# Altium schematic sheet IO_Combo_USB_Serial.SchDoc: USB Serial
size Tabloid; Date: 09/21/2024; Engineer: Terry D. Schevker; Revision: 1.0; SheetNumber: 4; SheetTotal: 5
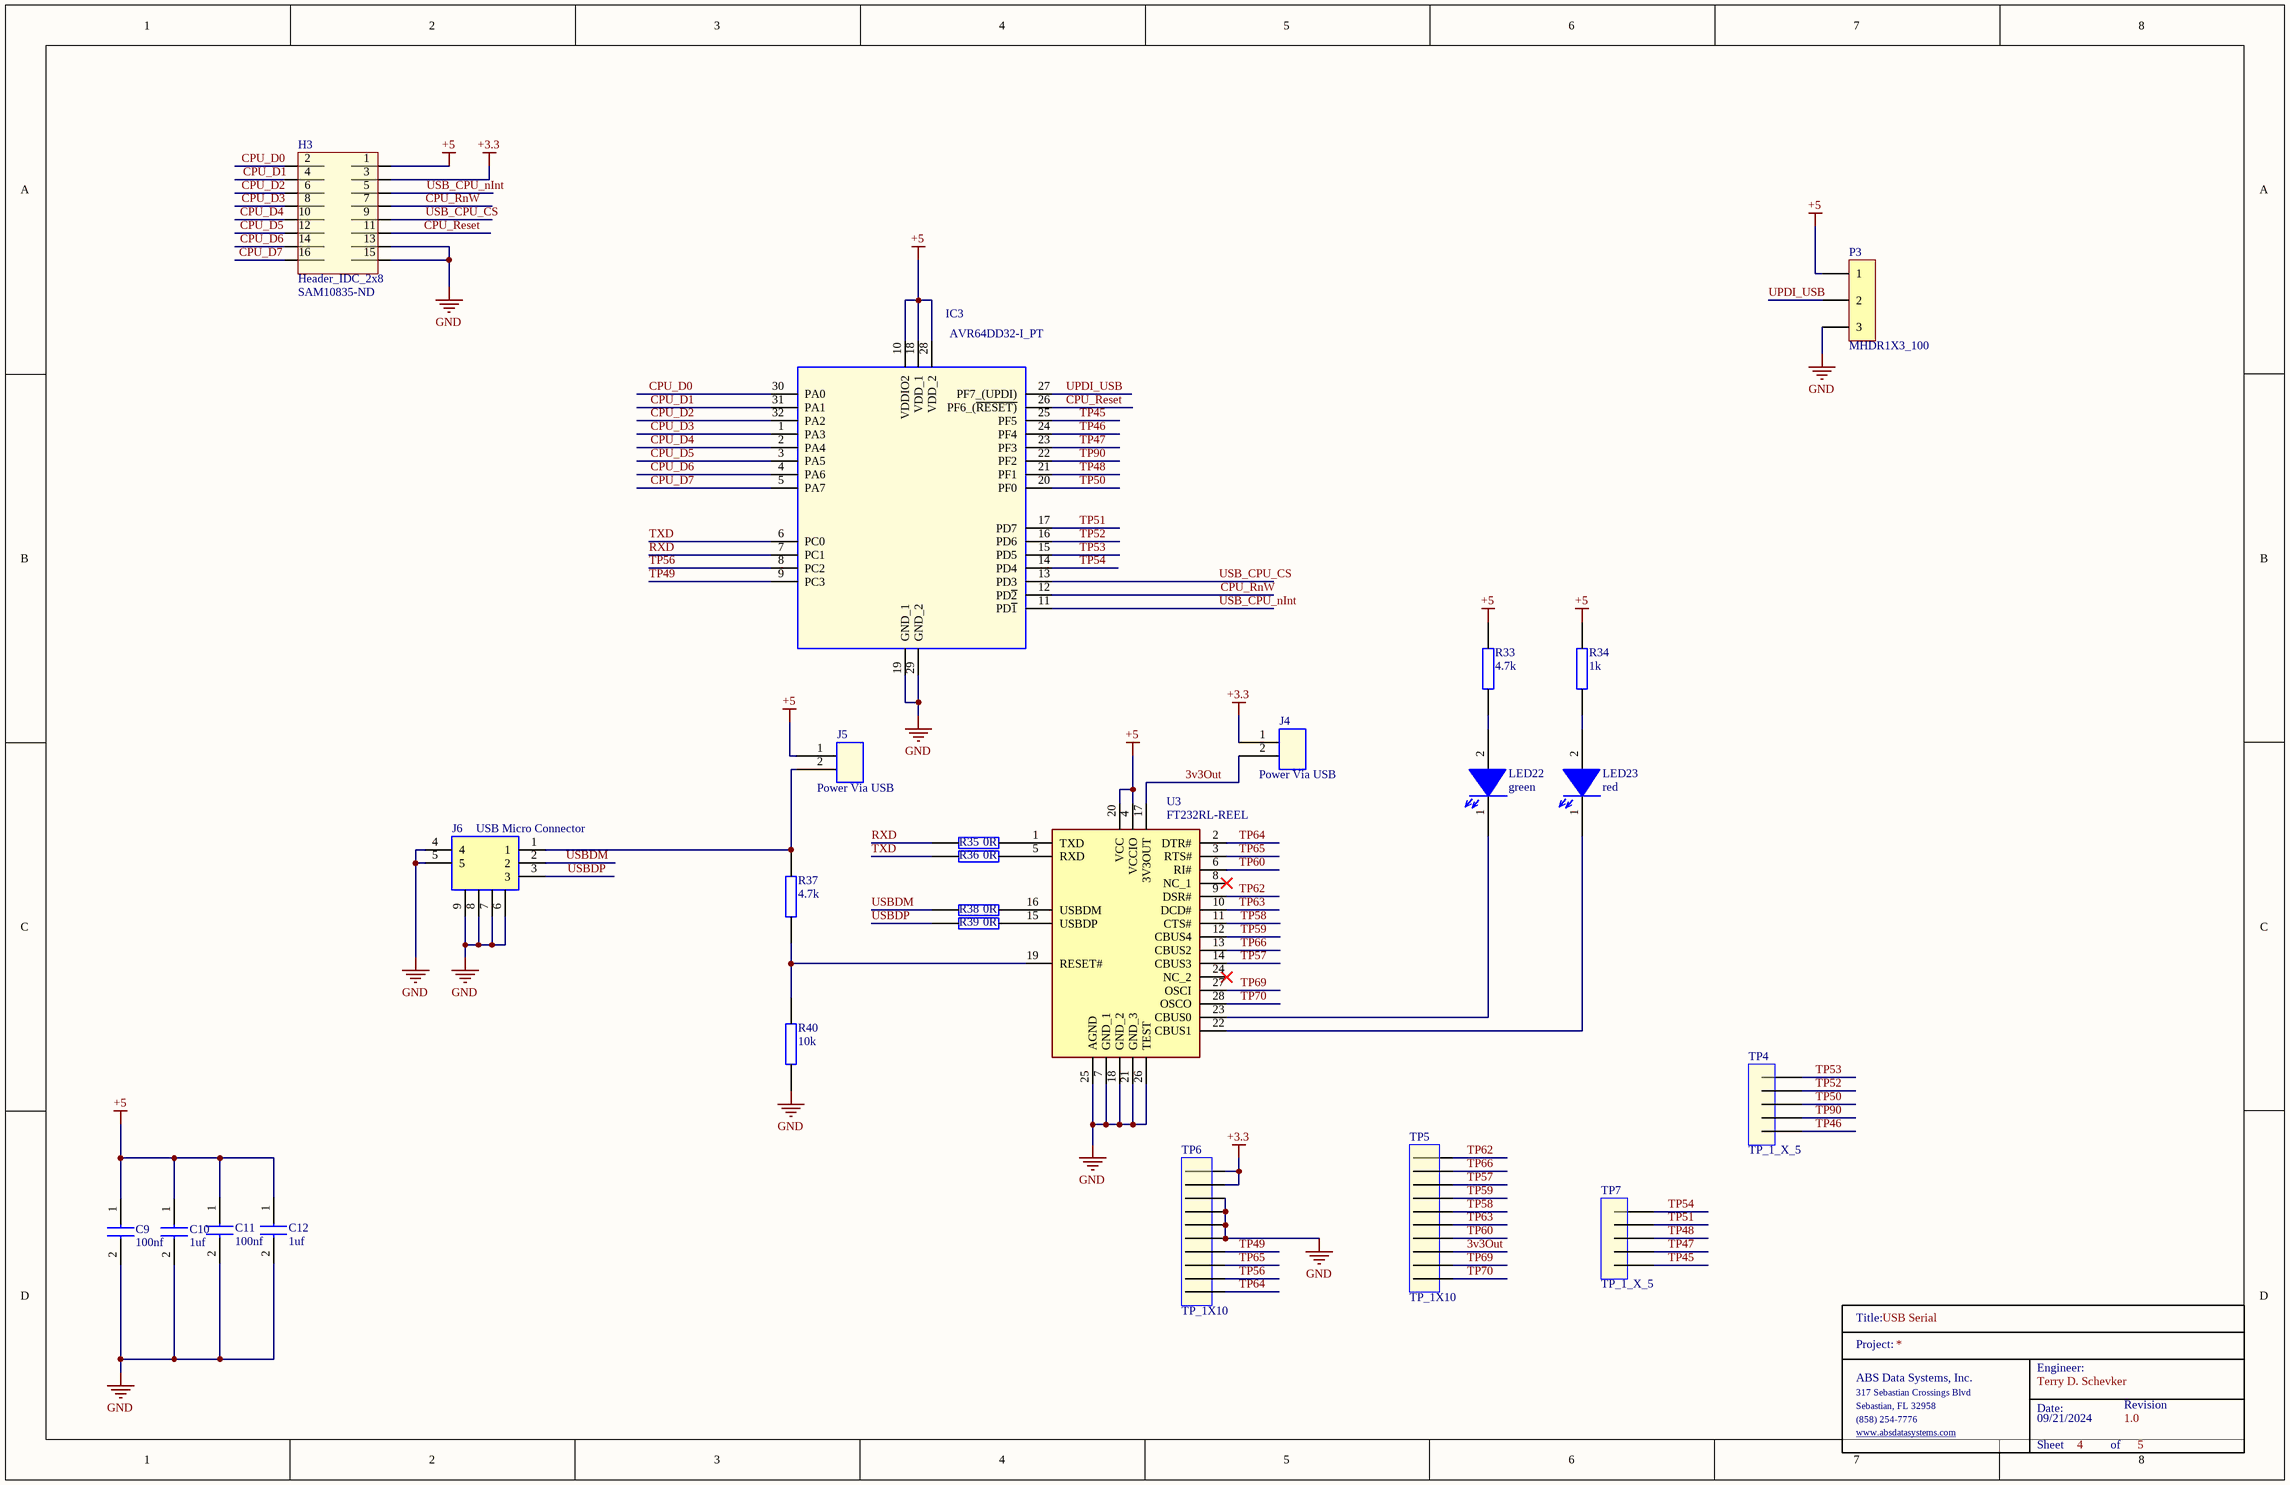
[diagram p0: IO_Combo_USB_Serial.SchDoc]

## Parts
C9  100nf  [0603]
C10  1uf  [0603]
C11  100nf  [0603]
C12  1uf  [0603]
H3  Header_IDC_2x8  Supplier Part Number 1: SAM10835-ND  [HEADER16]
IC3  AVR64DD32-I_PT  [QFP80P900X900X120-32N]
J4  Power Via USB  [Jumper]
J5  Power Via USB  [Jumper]
J6  USB Micro Connector  [1734035-2USB]
LED22  green  [0603_Diode]
LED23  red  [0603_Diode]
P3  MHDR1X3_100  [MHDR1X3_100]
R33  4.7k  [0603]
R34  1k  [0603]
R35  0R  [0603]
R36  0R  [0603]
R37  4.7k  [0603]
R38  0R  [0603]
R39  0R  [0603]
R40  10k  [0603]
TitleBlock_1  TitleBlock  (value not drawn)  (graphical)
TP4  TP_1_X_5  [TP_1X5]
TP5  TP_1X10  [TP_1X10]
TP6  TP_1X10  [TP_1X10]
TP7  TP_1_X_5  [TP_1X5]
U3  FT232RL-REEL  [SOIC-28_Narrow]

## Nets
+3.3: H3.3 J4.1 TP6.1 TP6.2
+5: C9.1 C10.1 C11.1 C12.1 H3.1 IC3.10(VDDIO2) IC3.18(VDD_1) IC3.28(VDD_2) J5.1 P3.1 R33.2 R34.2 U3.4(VCCIO) U3.20(VCC)
GND: C9.2 C10.2 C11.2 C12.2 H3.13 H3.15 IC3.19(GND_1) IC3.29(GND_2) J6.4 J6.5 J6.6(Shield) J6.7(Shield) J6.8(Shield) J6.9(Shield5) P3.3 R40.1 TP6.3 TP6.4 TP6.5 TP6.6 U3.7(GND_1) U3.18(GND_2) U3.21(GND_3) U3.25(AGND) U3.26(TEST)
3v3Out: J4.2 TP5.8 U3.17(3V3OUT)
CPU_D0: H3.2 IC3.30(PA0)
CPU_D1: H3.4 IC3.31(PA1)
CPU_D2: H3.6 IC3.32(PA2)
CPU_D3: H3.8 IC3.1(PA3)
CPU_D4: H3.10 IC3.2(PA4)
CPU_D5: H3.12 IC3.3(PA5)
CPU_D6: H3.14 IC3.4(PA6)
CPU_D7: H3.16 IC3.5(PA7)
CPU_Reset: H3.11 IC3.26(PF6_(~{RESET)})
CPU_RnW: H3.7 IC3.12(PD~{2})
RXD: IC3.7(PC1) R35.1
TP45: IC3.25(PF5) TP7.5
TP46: IC3.24(PF4) TP4.5
TP47: IC3.23(PF3) TP7.4
TP48: IC3.21(PF1) TP7.3
TP49: IC3.9(PC3) TP6.7
TP50: IC3.20(PF0) TP4.3
TP51: IC3.17(PD7) TP7.2
TP52: IC3.16(PD6) TP4.2
TP53: IC3.15(PD5) TP4.1
TP54: IC3.14(PD4) TP7.1
TP56: IC3.8(PC2) TP6.9
TP57: TP5.3 U3.14(CBUS3)
TP58: TP5.5 U3.11(CTS#)
TP59: TP5.4 U3.12(CBUS4)
TP60: TP5.7 U3.6(RI#)
TP62: TP5.1 U3.9(DSR#)
TP63: TP5.6 U3.10(DCD#)
TP64: TP6.10 U3.2(DTR#)
TP65: TP6.8 U3.3(RTS#)
TP66: TP5.2 U3.13(CBUS2)
TP69: TP5.9 U3.27(OSCI)
TP70: TP5.10 U3.28(OSCO)
TP90: IC3.22(PF2) TP4.4
TXD: IC3.6(PC0) R36.1
UPDI_USB: IC3.27(PF7_(UPDI)) P3.2
USB_CPU_CS: H3.9 IC3.13(PD3)
USB_CPU_nInt: H3.5 IC3.11(PD~{1})
USBDM: J6.2 R38.1
USBDP: J6.3 R39.1
NetJ5_2: J5.2 J6.1 R37.2
NetLED22_1: LED22.1(K) U3.23(CBUS0)
NetLED22_2: LED22.2(A) R33.1
NetLED23_1: LED23.1(K) U3.22(CBUS1)
NetLED23_2: LED23.2(A) R34.1
NetR35_2: R35.2 U3.1(TXD)
NetR36_2: R36.2 U3.5(RXD)
NetR37_1: R37.1 R40.2 U3.19(RESET#)
NetR38_2: R38.2 U3.16(USBDM)
NetR39_2: R39.2 U3.15(USBDP)

Not connected (* = marked no-connect by the designer): U3 8(NC_1)* 24(NC_2)*

## Notes on the sheet
- (in symbol TitleBlock) Title:; Project:; Engineer:; ABS Data Systems, Inc.; 317 Sebastian Crossings Blvd; Sebastian, FL 32958; Date:; Revision; (858) 254-7776; www.absdatasystems.com; Sheet; of

## Library data of the parts
C9 C11 = CL10B104JB8NNNC: Samsung Electro-Mechanics 0603 100nf
C10 C12 = CL10B105KA8NNNL: Samsung Electro-Mechanics 0603 1uf
H3 = Header_IDC_2x8: 16 Pin 2x8 Through Hold IDC Connector; Manufacturer: Samtec; Manufacturer Part Number: TST-108-01-G-D; Number of Contacts: 16; Gender: Male; Connector Type: Male Pin; Pitch: 2.54mm; Row Spacing: 0.1inch; Supplier 1: Digi-Key; RoHS: Yes; Category: Headers and Wire Housings; Stock 1: 227; Pricing 1: 1=2.85000, 10=2.73600, 100=2.28000, 500=1.93800, 1000=1.65300, 5000=1.48200 (USD); Mount: Through Hole; Contact Plating: Gold; Contact Material: Bronze; Housing Material: Polyester; Housing Color: Black; Color: Black; Min Operating Temperature: -55°C; Max Operating Temperature: 125°C; Number of Rows: 2; Termination: Solder; Packaging: Rail/Tube; Orientation: Straight; Number of Positions: 16; Length: 27.94mm; Depth: 9.27mm; Contact Mating Length: 0.25inch; REACH SVHC: No SVHC; ComponentLink1URL: https://datasheet.ciiva.com/739/tst-mkt-739845.pdf?src-supplier=Digi-Key; ComponentLink1Description: https://datasheet.ciiva.com/739/tst-mkt-739845.pdf?src-supplier=Digi-Key; ComponentLink2URL: https://datasheet.ciiva.com/10018/htst-10018510.pdf?src-supplier=Avnet; ComponentLink2Description: https://datasheet.ciiva.com/10018/htst-10018510.pdf?src-supplier=Avnet
IC3 = AVR64DD32-I_PT: Integrated Circuit; Manufacturer_Name: Microchip; Manufacturer_Part_Number: AVR64DD32-I/PT | MULTI-VOLTAGE I/O; Datasheet Link: https://www.microchip.com/en-us/product/AVR64DD32; Height: 1.2mm
J4 J5 = Jumper: 16 Pin 3x8 Through Hold Jumprts; Manufacturer: Samtec; Manufacturer Part Number: TST-108-01-G-D; Number of Contacts: 16; Gender: Male; Connector Type: Male Pin; Pitch: 2.54mm; Row Spacing: 0.1inch; Supplier 1: Digi-Key; RoHS: Yes; Category: Headers and Wire Housings; Stock 1: 227; Pricing 1: 1=2.85000, 10=2.73600, 100=2.28000, 500=1.93800, 1000=1.65300, 5000=1.48200 (USD); Mount: Through Hole; Contact Plating: Gold; Contact Material: Bronze; Housing Material: Polyester; Housing Color: Black; Color: Black; Min Operating Temperature: -55°C; Max Operating Temperature: 125°C; Number of Rows: 2; Termination: Solder; Packaging: Rail/Tube; Orientation: Straight; Number of Positions: 16; Length: 27.94mm; Depth: 9.27mm; Contact Mating Length: 0.25inch; REACH SVHC: No SVHC; ComponentLink1URL: https://datasheet.ciiva.com/739/tst-mkt-739845.pdf?src-supplier=Digi-Key; ComponentLink1Description: https://datasheet.ciiva.com/739/tst-mkt-739845.pdf?src-supplier=Digi-Key; ComponentLink2URL: https://datasheet.ciiva.com/10018/htst-10018510.pdf?src-supplier=Avnet; ComponentLink2Description: https://datasheet.ciiva.com/10018/htst-10018510.pdf?src-supplier=Avnet
J6 = 1734035-4: USB Micro Connector SMD; Manufacturer_Name: TE Connectivity; Datasheet Link: https://componentsearchengine.com//1734035-4.pdf; Mouser2 Part Number: 571-1734035-4; Mouser2 Price/Stock: https://www.mouser.com/Search/Refine.aspx?Keyword=571-1734035-4; Manufacturer_Part_Number: 1734035-4
LED22 = 150060GS75000: Wurth Elektronik 0603 green; Manufacturer: Wurth Electronics; Wavelength: 520nm; Viewing Angle: 140°; Lens Style: Clear,Rectangular; Luminous Intensity: 430mcd; Forward Current: 30mA; Forward Voltage: 3.2V; Test Current: 20mA; Supplier 1: Digi-Key; Manufacturer Part Number: 150060GS75000; RoHS: Yes; Category: LEDs; Stock 1: 71509; Pricing 1: 1=0.14000, 50=0.13300, 100=0.11400, 500=0.09900 (USD); Mount: Surface Mount; Case/Package: 0603; Color: Green; Case Code (Metric): 1608; Case Code (Imperial): 0603; Min Operating Temperature: -40°C; Max Operating Temperature: 85°C; Package Quantity: 4000; Packaging: Tape and Reel; Dominant Wavelength: 520nm; Length: 1.6mm; Width: 0.8mm; Height: 0.7mm; REACH SVHC: Unknown; Lead Free: Lead Free; ComponentLink1URL: https://datasheet.ciiva.com/29562/150060gs75000-29562868.pdf?src-supplier=Digi-Key; ComponentLink1Description: https://datasheet.ciiva.com/29562/150060gs75000-29562868.pdf?src-supplier=Digi-Key; ComponentLink2URL: https://datasheet.ciiva.com/29279/759427-da-01-en-chipled-0603-w-kl-gruen-150060gs75000-29279201.pdf?src-supplier=Conrad; ComponentLink2Description: https://datasheet.ciiva.com/29279/759427-da-01-en-chipled-0603-w-kl-gruen-150060gs75000-29279201.pdf?src-supplier=Conrad; ComponentLink3URL: https://datasheet.ciiva.com/29562/150060gs75000-29562869.pdf?src-supplier=Digi-Key; ComponentLink3Description: https://datasheet.ciiva.com/29562/150060gs75000-29562869.pdf?src-supplier=Digi-Key; ComponentLink4URL: https://datasheet.ciiva.com/29562/150060gs75000-29562870.pdf?src-supplier=Digi-Key; ComponentLink4Description: https://datasheet.ciiva.com/29562/150060gs75000-29562870.pdf?src-supplier=Digi-Key
LED23 = 150060RS75000: Wurth Elektronik 0603 red; Manufacturer: Wurth Electronics; Manufacturer Part Number: 150060GS75000; Color: Green; Wavelength: 520nm; Viewing Angle: 140°; Lens Style: Clear,Rectangular; Luminous Intensity: 430mcd; Forward Current: 30mA; Forward Voltage: 3.2V; Test Current: 20mA; Supplier 1: Digi-Key; RoHS: Yes; Category: LEDs; Stock 1: 71509; Pricing 1: 1=0.14000, 50=0.13300, 100=0.11400, 500=0.09900 (USD); Mount: Surface Mount; Case/Package: 0603; Case Code (Metric): 1608; Case Code (Imperial): 0603; Min Operating Temperature: -40°C; Max Operating Temperature: 85°C; Package Quantity: 4000; Packaging: Tape and Reel; Dominant Wavelength: 520nm; Length: 1.6mm; Width: 0.8mm; Height: 0.7mm; REACH SVHC: Unknown; Lead Free: Lead Free; ComponentLink1URL: https://datasheet.ciiva.com/29562/150060gs75000-29562868.pdf?src-supplier=Digi-Key; ComponentLink1Description: https://datasheet.ciiva.com/29562/150060gs75000-29562868.pdf?src-supplier=Digi-Key; ComponentLink2URL: https://datasheet.ciiva.com/29279/759427-da-01-en-chipled-0603-w-kl-gruen-150060gs75000-29279201.pdf?src-supplier=Conrad; ComponentLink2Description: https://datasheet.ciiva.com/29279/759427-da-01-en-chipled-0603-w-kl-gruen-150060gs75000-29279201.pdf?src-supplier=Conrad; ComponentLink3URL: https://datasheet.ciiva.com/29562/150060gs75000-29562869.pdf?src-supplier=Digi-Key; ComponentLink3Description: https://datasheet.ciiva.com/29562/150060gs75000-29562869.pdf?src-supplier=Digi-Key; ComponentLink4URL: https://datasheet.ciiva.com/29562/150060gs75000-29562870.pdf?src-supplier=Digi-Key; ComponentLink4Description: https://datasheet.ciiva.com/29562/150060gs75000-29562870.pdf?src-supplier=Digi-Key
P3 = MHDR1X3_100: Header, 3-Pin; LatestRevisionDate: 17-Jul-2002; LatestRevisionNote: Re-released for DXP Platform.; Publisher: Altium Limited
R33 R37 = RC0603FR-104K7L: YAGEO 0603 4.7k; Manufacturer_Name: KEMET; Manufacturer_Part_Number: RC0603JR-070RL; Geometry.Height: 0.55mm; Mouser Part Number: 603-RC0603JR-070RL; Mouser Price/Stock: https://www.mouser.co.uk/ProductDetail/YAGEO/RC0603JR-070RL?qs=2cAdsCoAWRGWyPcuXgGiXQ%3D%3D; Datasheet Link: https://datasheet.datasheetarchive.com/originals/distributors/Datasheets_SAMA/902f9e387b938f871d31120f5fc1d65e.pdf
R34 = AC0603FR-7W1KL_1: YAGEO 0603 1k ohm; Manufacturer_Name: KEMET; Manufacturer_Part_Number: RC0603JR-070RL; Geometry.Height: 0.55mm; Mouser Part Number: 603-RC0603JR-070RL; Mouser Price/Stock: https://www.mouser.co.uk/ProductDetail/YAGEO/RC0603JR-070RL?qs=2cAdsCoAWRGWyPcuXgGiXQ%3D%3D; Datasheet Link: https://datasheet.datasheetarchive.com/originals/distributors/Datasheets_SAMA/902f9e387b938f871d31120f5fc1d65e.pdf
R35 R36 R38 R39 = RC0603JR-070RL: YAGEO 0603 0 ohm; Manufacturer_Name: KEMET; Geometry.Height: 0.55mm; Mouser Part Number: 603-RC0603JR-070RL; Mouser Price/Stock: https://www.mouser.co.uk/ProductDetail/YAGEO/RC0603JR-070RL?qs=2cAdsCoAWRGWyPcuXgGiXQ%3D%3D; Manufacturer_Part_Number: RC0603JR-070RL; Datasheet Link: https://datasheet.datasheetarchive.com/originals/distributors/Datasheets_SAMA/902f9e387b938f871d31120f5fc1d65e.pdf
R40 = RC0603JR-0710KL: YAGEO 0603 10k ohm; Manufacturer_Name: KEMET; Manufacturer_Part_Number: RC0603JR-070RL; Geometry.Height: 0.55mm; Mouser Part Number: 603-RC0603JR-070RL; Mouser Price/Stock: https://www.mouser.co.uk/ProductDetail/YAGEO/RC0603JR-070RL?qs=2cAdsCoAWRGWyPcuXgGiXQ%3D%3D; Datasheet Link: https://datasheet.datasheetarchive.com/originals/distributors/Datasheets_SAMA/902f9e387b938f871d31120f5fc1d65e.pdf
TP4 TP7 = TP_1_X_5: Manufacturer: Samtec; Manufacturer Part Number: TST-105-01-G-D; Number of Contacts: 16; Gender: Male; Connector Type: Male Pin; Pitch: 2.54mm; Row Spacing: 0.1inch; Supplier 1: Digi-Key; RoHS: Yes; Category: Headers and Wire Housings; Stock 1: 227; Pricing 1: 1=2.85000, 10=2.73600, 100=2.28000, 500=1.93800, 1000=1.65300, 5000=1.48200 (USD); Mount: Through Hole; Contact Plating: Gold; Contact Material: Bronze; Housing Material: Polyester; Housing Color: Black; Color: Black; Min Operating Temperature: -55°C; Max Operating Temperature: 125°C; Number of Rows: 2; Termination: Solder; Packaging: Rail/Tube; Orientation: Straight; Number of Positions: 16; Length: 27.94mm; Depth: 9.27mm; Contact Mating Length: 0.25inch; REACH SVHC: No SVHC; ComponentLink1URL: https://datasheet.ciiva.com/739/tst-mkt-739845.pdf?src-supplier=Digi-Key; ComponentLink1Description: https://datasheet.ciiva.com/739/tst-mkt-739845.pdf?src-supplier=Digi-Key; ComponentLink2URL: https://datasheet.ciiva.com/10018/htst-10018510.pdf?src-supplier=Avnet; ComponentLink2Description: https://datasheet.ciiva.com/10018/htst-10018510.pdf?src-supplier=Avnet
TP5 TP6 = TP_1X10: Manufacturer: Samtec; Manufacturer Part Number: TST-105-01-G-D; Number of Contacts: 16; Gender: Male; Connector Type: Male Pin; Pitch: 2.54mm; Row Spacing: 0.1inch; Supplier 1: Digi-Key; RoHS: Yes; Category: Headers and Wire Housings; Stock 1: 227; Pricing 1: 1=2.85000, 10=2.73600, 100=2.28000, 500=1.93800, 1000=1.65300, 5000=1.48200 (USD); Mount: Through Hole; Contact Plating: Gold; Contact Material: Bronze; Housing Material: Polyester; Housing Color: Black; Color: Black; Min Operating Temperature: -55°C; Max Operating Temperature: 125°C; Number of Rows: 2; Termination: Solder; Packaging: Rail/Tube; Orientation: Straight; Number of Positions: 16; Length: 27.94mm; Depth: 9.27mm; Contact Mating Length: 0.25inch; REACH SVHC: No SVHC; ComponentLink1URL: https://datasheet.ciiva.com/739/tst-mkt-739845.pdf?src-supplier=Digi-Key; ComponentLink1Description: https://datasheet.ciiva.com/739/tst-mkt-739845.pdf?src-supplier=Digi-Key; ComponentLink2URL: https://datasheet.ciiva.com/10018/htst-10018510.pdf?src-supplier=Avnet; ComponentLink2Description: https://datasheet.ciiva.com/10018/htst-10018510.pdf?src-supplier=Avnet
U3 = FT232RL-REEL: USB-Serial SMD; Manufacturer_Name: FTDI Chip; Datasheet Link: http://www.ftdichip.com/Support/Documents/DataSheets/ICs/DS_FT232R.pdf; Height: 2mm; Manufacturer_Part_Number: FT232RL-REEL